# EAGLE design Bottom (EAGLE 9.2.2)
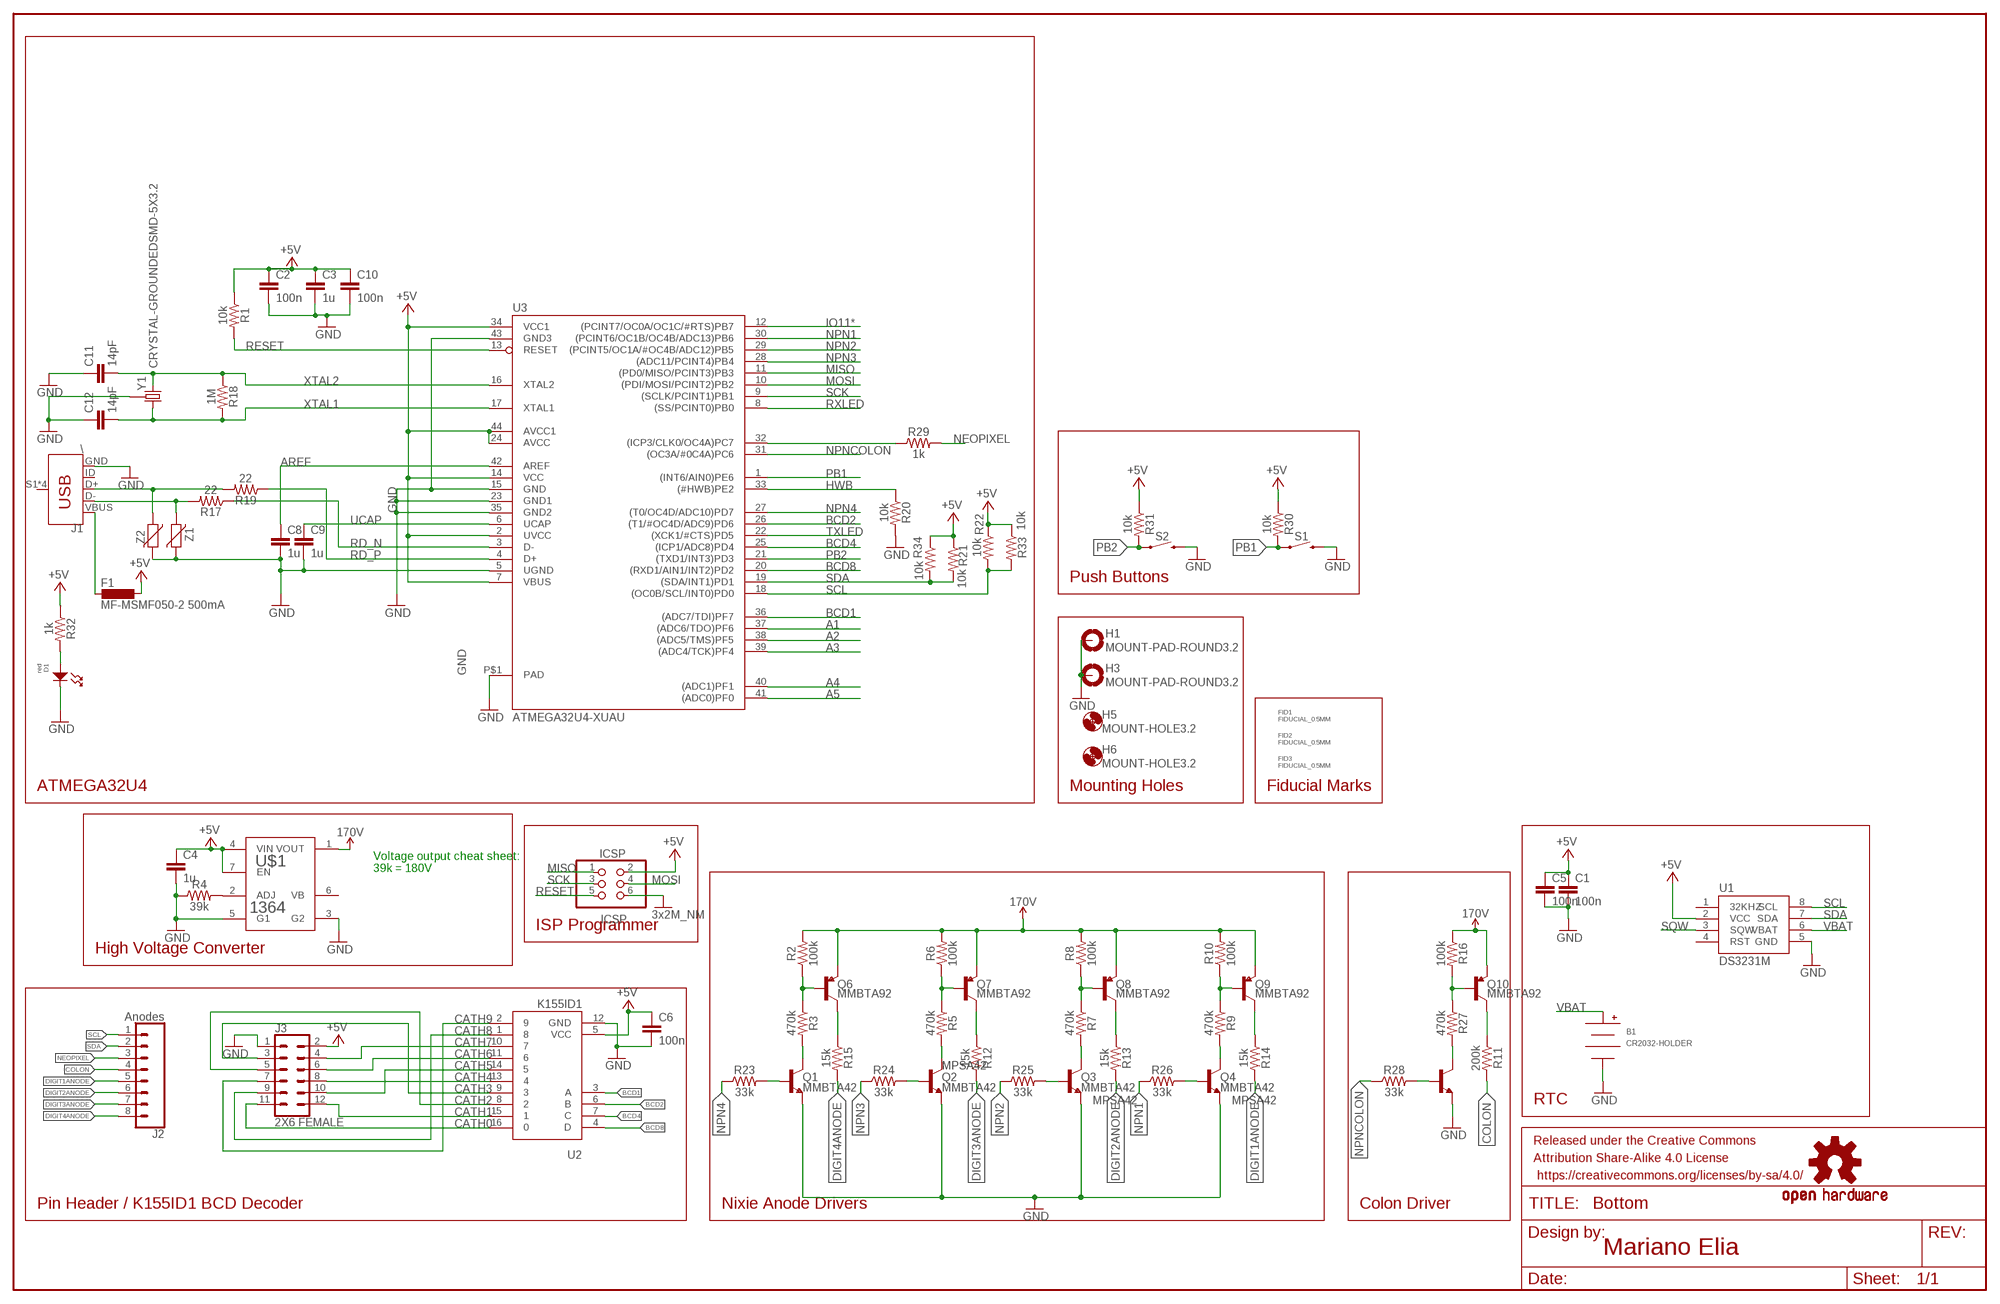
[diagram p0: schematic, sheet 1]

## Parts
B1  CR2032-HOLDER  [CH28-2032LF]
C1  100n  2.2UF-0805-25V-(+80/-20%)  [0805]
C2  100n  2.2UF-0805-25V-(+80/-20%)  [0805]
C3  1u  2.2UF-0805-25V-(+80/-20%)  [0805]
C4  1u  2.2UF-0805-25V-(+80/-20%)  [0805]
C5  100n  2.2UF-0805-25V-(+80/-20%)  [0805]
C6  100n  2.2UF-0805-25V-(+80/-20%)  [0805]
C8  1u  2.2UF-0805-25V-(+80/-20%)  [0805]
C9  1u  2.2UF-0805-25V-(+80/-20%)  [0805]
C10  100n  2.2UF-0805-25V-(+80/-20%)  [0805]
C11  14pF  2.2UF-0805-25V-(+80/-20%)  [0805]
C12  14pF  2.2UF-0805-25V-(+80/-20%)  [0805]
D1  red  LED_SINGLE-0805  [LED0805]
F1  MF-MSMF050-2 500mA  L-EUL1812  [L1812]
FID1  FIDUCIAL_0.5MM  [FIDUCIAL_0.5MM]
FID2  FIDUCIAL_0.5MM  [FIDUCIAL_0.5MM]
FID3  FIDUCIAL_0.5MM  [FIDUCIAL_0.5MM]
FRAME1  FRAME-LEDGER  [CREATIVE_COMMONS]
H1  MOUNT-PAD-ROUND3.2  [3,2-PAD]
H3  MOUNT-PAD-ROUND3.2  [3,2-PAD]
H5  MOUNT-HOLE3.2  [3,2]
H6  MOUNT-HOLE3.2  [3,2]
ICSP  ICSP  PINHD-2X3  [2X03]
J1  \  USB_MINI-B_SMT  [USB-MINIB]
J2  Anodes  CONN_08NO_SILK_FEMALE_PTH  [1X08_NO_SILK]
J3  2X6 FEMALE  CONN_06X2NO_SILK  [2X6_NOSILK]
LOGO1  OSHW-LOGOL  [OSHW-LOGO-L]
Q1  MMBTA42  TRANS_NPN-MMBTA42  [SOT23-3]
Q2  MMBTA42  TRANS_NPN-MMBTA42  [SOT23-3]
Q3  MMBTA42  TRANS_NPN-MMBTA42  [SOT23-3]
Q4  MMBTA42  TRANS_NPN-MMBTA42  [SOT23-3]
Q5  MMBTA42  TRANS_NPN-MMBTA42  [SOT23-3]
Q6  MMBTA92  TRANS_PNP-MMBT4403  [SOT23-3]
Q7  MMBTA92  TRANS_PNP-MMBT4403  [SOT23-3]
Q8  MMBTA92  TRANS_PNP-MMBT4403  [SOT23-3]
Q9  MMBTA92  TRANS_PNP-MMBT4403  [SOT23-3]
Q10  MMBTA92  TRANS_PNP-MMBT4403  [SOT23-3]
R1  10k  0.75OHM-0805-1/4W-1%  [0805]
R2  100k  0.75OHM-0805-1/4W-1%  [0805]
R3  470k  0.75OHM-0805-1/4W-1%  [0805]
R4  39k  0.3OHM-0805-1/8W-1%  [0805]
R5  470k  0.75OHM-0805-1/4W-1%  [0805]
R6  100k  0.75OHM-0805-1/4W-1%  [0805]
R7  470k  0.75OHM-0805-1/4W-1%  [0805]
R8  100k  0.75OHM-0805-1/4W-1%  [0805]
R9  470k  0.75OHM-0805-1/4W-1%  [0805]
R10  100k  0.75OHM-0805-1/4W-1%  [0805]
R11  200k  0.75OHM-0805-1/4W-1%  [0805]
R12  15k  0.75OHM-0805-1/4W-1%  [0805]
R13  15k  0.75OHM-0805-1/4W-1%  [0805]
R14  15k  0.75OHM-0805-1/4W-1%  [0805]
R15  15k  0.75OHM-0805-1/4W-1%  [0805]
R16  100k  0.75OHM-0805-1/4W-1%  [0805]
R17  22  0.75OHM-0805-1/4W-1%  [0805]
R18  1M  0.75OHM-0805-1/4W-1%  [0805]
R19  22  0.75OHM-0805-1/4W-1%  [0805]
R20  10k  0.75OHM-0805-1/4W-1%  [0805]
R21  10k  0.75OHM-0805-1/4W-1%  [0805]
R22  10k  0.75OHM-0805-1/4W-1%  [0805]
R23  33k  0.75OHM-0805-1/4W-1%  [0805]
R24  33k  0.75OHM-0805-1/4W-1%  [0805]
R25  33k  0.75OHM-0805-1/4W-1%  [0805]
R26  33k  0.75OHM-0805-1/4W-1%  [0805]
R27  470k  0.75OHM-0805-1/4W-1%  [0805]
R28  33k  0.75OHM-0805-1/4W-1%  [0805]
R29  1k  0.75OHM-0805-1/4W-1%  [0805]
R30  10k  0.75OHM-0805-1/4W-1%  [0805]
R31  10k  0.75OHM-0805-1/4W-1%  [0805]
R32  1k  0.75OHM-0805-1/4W-1%  [0805]
R33  10k  0.75OHM-0805-1/4W-1%  [0805]
R34  10k  0.75OHM-0805-1/4W-1%  [0805]
S1  MOMENTARY-SWITCH-SPST-PTH-RIGHT-ANGLE-KIT  [TACTILE_SWITCH_PTH_RIGHT_ANGLE_KIT]
S2  MOMENTARY-SWITCH-SPST-PTH-RIGHT-ANGLE-KIT  [TACTILE_SWITCH_PTH_RIGHT_ANGLE_KIT]
U1  DS3231M  [SO08]
U2  K155ID1  [DIL16-KIT]
U3  ATMEGA32U4-XUAU  [TQFP44-PAD]
U$1  1364  [1364]
Y1  CRYSTAL-GROUNDEDSMD-5X3.2  [CRYSTAL-SMD-5X3.2-4PAD]
Z1  VARISTORCN0603  [CT/CN0603]
Z2  VARISTORCN0603  [CT/CN0603]

## Nets
170V [170V]: Q6.2(E) Q7.2(E) Q8.2(E) Q9.2(E) Q10.2(E) R2.2 R6.2 R8.2 R10.2 R16.1 U$1.1(VOUT)
+5V [5V]: C1.1 C2.1 C3.1 C4.1 C5.1 C6.1 C10.1 F1.1 ICSP.2 J3.2 R1.1 R21.1 R22.1 R30.1 R31.1 R32.1 R33.1 R34.1 U1.2(VCC) U2.5(VCC) U3.2(UVCC) U3.7(VBUS) U3.14(VCC) U3.24(AVCC) U3.34(VCC1) U3.44(AVCC1) U$1.4(VIN) U$1.7(EN)
A1: U3.37((ADC6/TDO)PF6)
A2: U3.38((ADC5/TMS)PF5)
A3: U3.39((ADC4/TCK)PF4)
A4: U3.40((ADC1)PF1)
A5: U3.41((ADC0)PF0)
AREF [aref]: C8.1 U3.42(AREF)
BCD1: U2.3(A) U3.36((ADC7/TDI)PF7)
BCD2: U2.6(B) U3.26((T1/#OC4D/ADC9)PD6)
BCD4: U2.7(C) U3.25((ICP1/ADC8)PD4)
BCD8: U2.4(D) U3.20((RXD1/AIN1/INT2)PD2)
CATH0: J3.11 U2.16
CATH1: J3.12 U2.15
CATH2: J3.5 U2.8
CATH3: J3.3 U2.9
CATH4: J3.8 U2.13
CATH5: J3.10 U2.14
CATH6: J3.6 U2.11
CATH7: J3.4 U2.10
CATH8: J3.9 U2.1
CATH9: J3.7 U2.2
COLON: J2.4 R11.2
D_N [USBDiff]: J1.D- R17.2 Z1.1
D_P [USBDiff]: J1.D+ R19.2 Z2.1
DIGIT1ANODE: J2.5 R14.2
DIGIT2ANODE: J2.6 R13.2
DIGIT3ANODE: J2.7 R12.2
DIGIT4ANODE: J2.8 R15.2
GND: B1.NEG C1.2 C2.2 C3.2 C4.2 C5.2 C6.2 C8.2 C9.2 C10.2 C11.1 C12.1 D1.CATHODE H1.B3,2(MOUNT) H3.B3,2(MOUNT) ICSP.6 J1.GND J3.1 Q1.2(E) Q2.2(E) Q3.2(E) Q4.2(E) Q5.2(E) R4.1 R20.2 S1.2 S2.2 U1.5(GND) U2.12(GND) U3.5(UGND) U3.15(GND) U3.23(GND1) U3.35(GND2) U3.43(GND3) U3.P$1(PAD) U$1.3(G2) U$1.5(G1) Y1.2 Y1.4 Z1.2 Z2.2 ; supply symbol labelled 3x2M_NM
HWB: R20.1 U3.33((#HWB)PE2)
IO11*: U3.12((PCINT7/OC0A/OC1C/#RTS)PB7)
MISO: ICSP.1 U3.11((PD0/MISO/PCINT3)PB3)
MOSI: ICSP.4 U3.10((PDI/MOSI/PCINT2)PB2)
N$1: Q1.1(B) R23.2
N$2: Q2.1(B) R24.2
N$3: R4.2 U$1.2(ADJ)
N$4: Q3.1(B) R25.2
N$5: Q4.1(B) R26.2
N$6: Q6.1(B) R2.1 R3.1
N$7: Q1.3(C) R3.2
N$8: Q7.1(B) R5.1 R6.1
N$9: Q8.1(B) R7.1 R8.1
N$10: Q9.1(B) R9.1 R10.1
N$11: Q4.3(C) R9.2
N$12: Q2.3(C) R5.2
N$14: Q3.3(C) R7.2
N$15: Q5.1(B) R28.2
N$16: Q10.1(B) R16.2 R27.1
N$17: R29.1 U3.32((ICP3/CLK0/OC4A)PC7)
N$18: Q5.3(C) R27.2
N$19: D1.ANODE R32.2
N$20: Q10.3(C) R11.1
N$23: Q7.3(C) R12.1
N$24: Q6.3(C) R15.1
N$25: Q8.3(C) R13.1
N$27: Q9.3(C) R14.1
NEOPIXEL: J2.3 R29.2
NPN1: R26.1 U3.30((PCINT6/OC1B/OC4B/ADC13)PB6)
NPN2: R25.1 U3.29((PCINT5/OC1A/#OC4B/ADC12)PB5)
NPN3: R24.1 U3.28((ADC11/PCINT4)PB4)
NPN4: R23.1 U3.27((T0/OC4D/ADC10)PD7)
NPNCOLON: R28.1 U3.31((OC3A/#0C4A)PC6)
PB1: R30.2 S1.1 U3.1((INT6/AIN0)PE6)
PB2: R31.2 S2.1 U3.21((TXD1/INT3)PD3)
RD_N [USBDiff]: R17.1 U3.3(D-)
RD_P [USBDiff]: R19.1 U3.4(D+)
RESET: ICSP.5 R1.2 U3.13(RESET)
RXLED: U3.8((SS/PCINT0)PB0)
SCK: ICSP.3 U3.9((SCLK/PCINT1)PB1)
SCL: J2.1 R22.2 R33.2 U1.8(SCL) U3.18((OC0B/SCL/INT0)PD0)
SDA: J2.2 R21.2 R34.2 U1.7(SDA) U3.19((SDA/INT1)PD1)
SQW: U1.3(SQW)
TXLED: U3.22((XCK1/#CTS)PD5)
UCAP: C9.1 U3.6(UCAP)
VBAT: B1.POS U1.6(VBAT)
VBUS: F1.2 J1.VBUS
XTAL1: C12.2 R18.2 U3.17(XTAL1) Y1.1
XTAL2: C11.2 R18.1 U3.16(XTAL2) Y1.3
Unconnected: J1.ID J1.S1(SHIELD) J1.S2(SHIELD) J1.S3(SHIELD) J1.S4(SHIELD) U1.1(32KHZ) U1.4(RST) U$1.6(VB)

## Notes on the sheet
- Push Buttons
- ATMEGA32U4 | Mounting Holes | Fiducial Marks
- Voltage output cheat sheet:
  39k = 180V
- ISP Programmer
- High Voltage Converter
- RTC
- Pin Header / K155ID1 BCD Decoder | Nixie Anode Drivers | Colon Driver
- Mariano Elia

## Library data of the parts
B1 = battery-holder:CR2032-HOLDER
C1-C6 C8-C12 = SparkFun-Capacitors:2.2UF: 2.2µF ceramic capacitors A capacitor is a passive two-terminal electrical component used to store electrical energy temporarily in an electric field.; PROD_ID: CAP-11624; VALUE: 2.2uF
D1 = MF_LEDs:LED_SINGLE: Library: MF_LEDs Description: Device for Single LED Packages. Manufacture part number (MFG#) can be added via Attributes.; HOUSEPART: NO; POPULATE: 1
F1 = rcl:L-EU: INDUCTOR, European symbol; SPICEPREFIX: L
FID1-FID3 = MF_Aesthetics:FIDUCIAL: Library: MF_Aesthetics Description: Fiducial marking for PCB alignment inside PNP and other machines.; HOUSEPART: NO; POPULATE: 0
FRAME1 = SparkFun-Aesthetics:FRAME-LEDGER: Schematic Frame - Ledger Standard 11x14 US Ledger frame
H1 H3 = holes:MOUNT-PAD-ROUND: MOUNTING PAD, round
H5 H6 = holes:MOUNT-HOLE: MOUNTING HOLE with drill center marker
ICSP = SmartPrj:PINHD-2X3: PIN HEADER
J1 = SparkFun-Connectors:USB_MINI-B: USB type Mini-B Connector Breaks out 5th pin, and includes shield pins if needed. SparkFun Products: SparkFun FTDI Basic Breakout <https://www.sparkfun.com/products/9716> SparkFun XBee Explorer USB <https://www.sparkfun.com/products/11812> SparkFun Redboard <https://www.sparkfun.com/products/12757>; PROD_ID: CONN-08193; SF_ID: PRT-00587
J2 = SparkFun-Connectors:CONN_08: Multi connection point. Often used as Generic Header-pin footprint for 0.1 inch spaced/style header connections On any of the 0.1 inch spaced packages, you can populate with these: Break Away Headers - Straight <https://www.sparkfun.com/products/116> (PRT-00116) Break Away Male Headers - Right Angle <https://www.sparkfun.com/products/553> (PRT-00553) Female Headers <https://www.sparkfun.com/products/115> (PRT-00115) Break Away Headers - Machine Pin <https://www.sparkfun.com/products/117> (PRT-00117) Break Away Female Headers - Swiss Machine Pin <https://www.sparkfun.com/products/743> (PRT-00743) Arduino Stackable Header - 8 Pin <https://www.sparkfun.com/products/9279> (PRT-09279) For SCREWTERMINALS and SPRING TERMINALS visit here: Screw Terimnals on SparkFun.com <https://www.sparkfun.com/search/results?term=Screw+Terminals> (5mm/3.5mm/2.54mm spacing) This device is also useful as a general connection point to wire up your design to another part of your project. Our various solder wires solder well into these plated through hole pads. Hook-Up Wire - Assortment (Stranded, 22 AWG) <https://www.sparkfun.com/products/11375> (PRT-11375) Hook-Up Wire - Assortment (Solid Core, 22 AWG) <https://www.sparkfun.com/products/11367> (PRT-11367) View the entire wire category on our website here <https://www.sparkfun.com/categories/141> Special notes: Molex polarized connector foot print use with SKU : PRT-08231 with associated crimp pins and housings. 1MM SMD Version SKU: PRT-10208 NOTES ON THE VARIANTS LOCK and LOCK_LONGPADS... This footprint was designed to help hold the alignment of a through-hole component (i.e. 6-pin header) while soldering it into place. You may notice that each hole has been shifted either up or down by 0.005 of an inch from it's more standard position (which is a perfectly straight line). This slight alteration caused the pins (the squares in the middle) to touch the edges of the holes. Because they are alternating, it causes a "brace" to hold the component in place. 0.005 has proven to be the perfect amount of "off-center" position when using our standard breakaway headers. Although looks a little odd when you look at the bare footprint, once you have a header in there, the alteration is very hard to notice. Also,if you push a header all the way into place, it is covered up entirely on the bottom side.; PROD_ID: CONN-08438
J3 = SparkFun-Connectors:CONN_06X2: Multi connection point. Often used as Generic Header-pin footprint for 0.1 inch spaced/style header connections On any of the 0.1 inch spaced packages, you can populate with these: Break Away Headers - Straight <https://www.sparkfun.com/products/116> (PRT-00116) Break Away Male Headers - Right Angle <https://www.sparkfun.com/products/553> (PRT-00553) Female Headers <https://www.sparkfun.com/products/115> (PRT-00115) Break Away Headers - Machine Pin <https://www.sparkfun.com/products/117> (PRT-00117) Break Away Female Headers - Swiss Machine Pin <https://www.sparkfun.com/products/743> (PRT-00743)
LOGO1 = SparkFun-Aesthetics:OSHW-LOGO: Open-Source Hardware (OSHW) Logo This logo indicates the piece of hardware it is found on incorporates a OSHW license and/or adheres to the definition of open source hardware found here: http://freedomdefined.org/OSHW
Q1-Q5 = SparkFun-DiscreteSemi:TRANS_NPN: NPN transistor Current controlled devices typically used to amplify current or used as a switch. BC547 - COM-08928 <http://www.sparkfun.com/products/8928> (TO-92 45V 100mA) (1.Collector 2.Base 3.Emitter) 2N3904 - COM-00521 <http://www.sparkfun.com/products/521> (TO-92 40V 200mA) (1.Emitter 2.Base 3.Collector) P2N2222A - COM-12852 <http://www.sparkfun.com/products/12852> (TO-92 40V 600mA) (1.Collector 2.Base 3.Emitter); PROD_ID: TRANS-09116; VALUE: 500mA/300V
Q6-Q10 = SparkFun-DiscreteSemi:TRANS_PNP: PNP transistor Current controlled devices typically used to amplify current or used as a switch. SparkFun Products: SparkFun Serial Enabled 16x2 LCD - Red on Black <https://www.sparkfun.com/products/9068> SparkFun Logomatic <https://www.sparkfun.com/products/12772>; PROD_ID: TRANS-09245; VALUE: 600mA/40V
R1-R3 R5-R34 = SparkFun-Resistors:0.75OHM: 0.75Ω resistor A resistor is a passive two-terminal electrical component that implements electrical resistance as a circuit element. Resistors act to reduce current flow, and, at the same time, act to lower voltage levels within circuits. - Wikipedia; PROD_ID: RES-08474; VALUE: 0.75
R4 = SparkFun-Resistors:0.3OHM: 0.3Ω resistor A resistor is a passive two-terminal electrical component that implements electrical resistance as a circuit element. Resistors act to reduce current flow, and, at the same time, act to lower voltage levels within circuits. - Wikipedia; PROD_ID: RES-11622; VALUE: 0.3
S1 S2 = SparkFun-Switches:MOMENTARY-SWITCH-SPST: Momentary Switch (Pushbutton) - SPST Normally-open (NO) SPST momentary switches (buttons, pushbuttons). Variants PTH-12MM - 12mm square, through-hole Momentary Pushbutton Switch - 12mm Square <https://www.sparkfun.com/products/9190> (COM-09190) PTH-6.0MM, PTH-6.0MM-KIT - 6.0mm square, through-hole Mini Pushbutton Switch <https://www.sparkfun.com/products/97> (COM-00097) KIT package intended for soldering kit's - only one side of pads' copper is exposed. PTH-RIGHT-ANGLE-KIT - Right-angle, through-hole Right Angle Tactile Button <https://www.sparkfun.com/products/10791> - Used on SparkFun BigTime Watch Kit <https://www.sparkfun.com/products/11734> SMD-12MM - 12mm square, surface-mount Tactile Button - SMD (12mm) <https://www.sparkfun.com/products/12993> (COM-12993) Used on SparkFun PicoBoard <https://www.sparkfun.com/products/11888> SMD-4.5MM - 4.5mm Square Trackball Switch Used on SparkFun Blackberry Trackballer Breakout <https://www.sparkfun.com/products/13169> SMD-4.6MMX2.8MM - 4.60mm x 2.80mm, surface mount Used on SparkFun SAMD21 Mini Breakout <https://www.sparkfun.com/products/13664> SMD-5.2MM, SMD-5.2-REDUNDANT - 5.2mm square, surface-mount Mini Pushbutton Switch - SMD <https://www.sparkfun.com/products/8720> (COM-08720) Used on Arduino Pro Mini <https://www.sparkfun.com/products/11114> REDUNDANT package connects both switch circuits together SMD-6.0X3.5MM - 6.0 x 3.5mm, surface mount Momentary Reset Switch SMD <https://www.sparkfun.com/products/8229> (COM-08229) SMD-6.2MM-TALL - 6.2mm square, surface mount Tactile Button - SMD (6mm) <https://www.sparkfun.com/products/12992> Used on SparkFun Digital Sandbox <https://www.sparkfun.com/products/12651> SMD-RIGHT-ANGLE - Right-angle, surface mount Used on SparkFun Block for Intel® Edison - Arduino <https://www.sparkfun.com/products/13036>; PROD_ID: CONN-10672; SF_SKU: COM-10791
U1 = SparkFun-Clocks:DS3231M: DS3231M Real Time Clock Accuracy +/-5ppm. Battery Backup. 2.3V to 5.5V. Datasheet <https://cdn.sparkfun.com/datasheets/Dev/Beagle/DS3231M.pdf> SparkFun Products CryptoCape <https://www.sparkfun.com/products/12773> (DEV-12773) SparkFun CryptoShield <https://www.sparkfun.com/products/13183> (DEV-13183); PROD_ID: IC-11985
U2 = Nixie:K155ID1
U3 = SmartPrj:ATMEGA32U4-XU
U$1 = TES:1364: TES1364 HVPS Horizontal module
Y1 = SparkFun-Clocks:CRYSTAL-GROUNDED: Crystals w/ Ground Pin (Generic) These are passive quartz crystals, which can be used as a clock source for a microcontroller. Crystal's are usually two-terminal devices. A third terminal may be optionally connected to ground, as recommended by the manufaturer.
Z1 Z2 = varistor:VARISTOR: VARISTOR

## Net classes
1 5V: width 0.3 mm, drill 0.4 mm, clearance 0.3 mm
2 GND: width 0.3 mm, drill 0.4 mm, clearance 0.254 mm
3 170V: width 0.254 mm, drill 0.4 mm, clearance 0.4 mm
4 aref: width 0.254 mm, drill 0.61 mm, clearance 0.254 mm
5 USBDiff: width 0.3 mm, drill 0.4 mm, clearance 0.1 mm

## Board
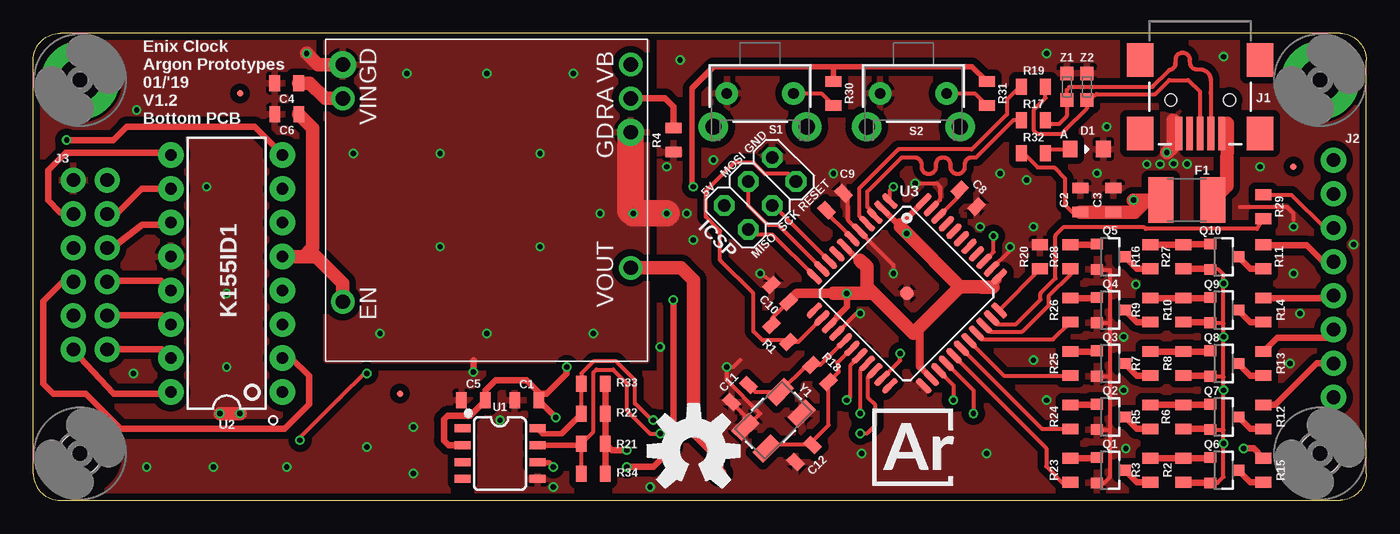
[diagram p1: board, top side]
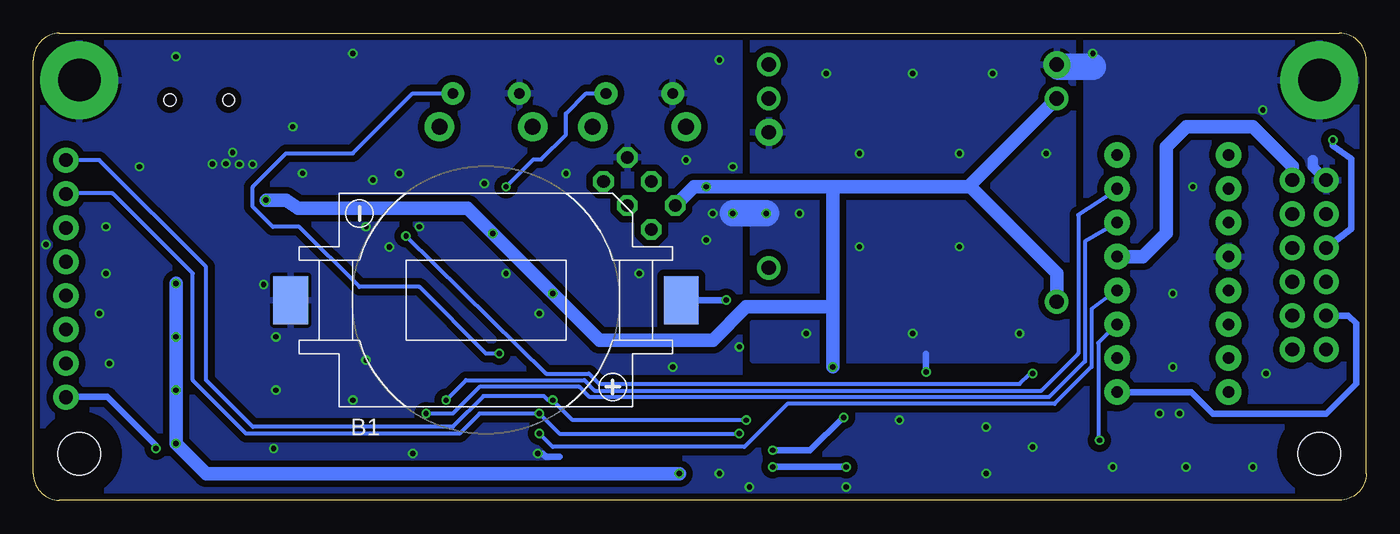
[diagram p2: board, bottom side, seen from below]

Size 99.95 x 35 mm. Coordinates in mm from the lower left corner, seen from the top.
Outline: 99.95,2 99.95,33 arc90 98,35 2,35 arc90 0,33 0,2 arc90 2,0 98,0 arc90 99.95,2
Copper layers (1*16): Top 0.035mm / dielectric 1.5mm / Bottom 0.035mm
Design rules "MF_4_mil_drill_2_Layer": minimum track width 5mil, minimum drill 4mil, track to track 5mil, track to pad 5mil, pad to pad 5mil, via to via 5mil, smd to smd 0mil, copper to edge 10mil, drill to drill 10mil, minimum pad ring 6mil, minimum via ring 6mil, stop-mask expansion 2mil, vias tented up to drill 25mil, thermal gap 10mil

### Footprints (pad centres in the part's own frame; a part is rotated, then mirrored left to right if it is on the bottom)
CH28-2032LF = smd 3.6 x 2.6: NEG 0,-14.65; POS 0,14.65
0805 = smd 0.8 x 1.2: 1 -0.9,0; 2 0.9,0
LED0805 = smd 1.1 x 1.25: ANODE 1.25,0; CATHODE -1.25,0
L1812 = smd 1.9 x 3.4: 1 -1.95,0; 2 1.95,0
FIDUCIAL_0.5MM = smd 0.5 x 0.5: FID 0,0
3,2-PAD = drill 3.2 pad 5.842: B3,2 0,0
3,2 = hole 3.2: 0,0
2X03 = drill 0.95 pad 1.55 octagon: 1 -2.54,-1.27; 2 -2.54,1.27; 3 0,-1.27; 4 0,1.27; 5 2.54,-1.27; 6 2.54,1.27
USB-MINIB = smd 2.5 x 0.5: D+ 2.5,0; D- 2.5,0.8; GND 2.5,-1.6; ID 2.5,-0.8; VBUS 2.5,1.6 | smd 2.5 x 2: S1 -3,4.5; S2 2.5,4.5; S3 -3,-4.5; S4 2.5,-4.5 | hole 0.9: 0,2.2; 0,-2.2
1X08_NO_SILK = drill 1.016 pad 1.88: 1 0,0; 2 2.54,0; 3 5.08,0; 4 7.62,0; 5 10.16,0; 6 12.7,0; 7 15.24,0; 8 17.78,0
2X6_NOSILK = drill 1.016 pad 1.88: 1 0,0; 2 0,2.54; 3 2.54,0; 4 2.54,2.54; 5 5.08,0; 6 5.08,2.54; 7 7.62,0; 8 7.62,2.54; 9 10.16,0; 10 10.16,2.54; 11 12.7,0; 12 12.7,2.54
SOT23-3 = smd 0.8 x 0.9: 1 -0.95,-1; 2 0.95,-1; 3 0,1.1
TACTILE_SWITCH_PTH_RIGHT_ANGLE_KIT = drill 0.8 pad 1.7: 1 -2.5,0; 2 2.5,0 | drill 1.2 pad 2.2: ANCHOR1 -3.5,2.5; ANCHOR2 3.5,2.5
SO08 = smd 0.6 x 1.2: 1 -1.905,-2.8; 2 -0.635,-2.8; 3 0.635,-2.8; 4 1.905,-2.8; 5 1.905,2.8; 6 0.635,2.8; 7 -0.635,2.8; 8 -1.905,2.8
DIL16-KIT = drill 0.864 pad 1.905: 1 -8.89,-4.191; 2 -6.35,-4.191; 3 -3.81,-4.191; 4 -1.27,-4.191; 5 1.27,-4.191; 6 3.81,-4.191; 7 6.35,-4.191; 8 8.89,-4.191; 9 8.89,4.191; 10 6.35,4.191; 11 3.81,4.191; 12 1.27,4.191; 13 -1.27,4.191; 14 -3.81,4.191; 15 -6.35,4.191; 16 -8.89,4.191
TQFP44-PAD = smd 1.4 x 0.45: 1 -5.8,4; 2 -5.8,3.2; 3 -5.8,2.4; 4 -5.8,1.6; 5 -5.8,0.8; 6 -5.8,0; 7 -5.8,-0.8; 8 -5.8,-1.6; 9 -5.8,-2.4; 10 -5.8,-3.2; 11 -5.8,-4; 23 5.8,-4; 24 5.8,-3.2; 25 5.8,-2.4; 26 5.8,-1.6; 27 5.8,-0.8; 28 5.8,0; 29 5.8,0.8; 30 5.8,1.6; 31 5.8,2.4; 32 5.8,3.2; 33 5.8,4 | smd 0.45 x 1.4: 12 -4,-5.8; 13 -3.2,-5.8; 14 -2.4,-5.8; 15 -1.6,-5.8; 16 -0.8,-5.8; 17 0,-5.8; 18 0.8,-5.8; 19 1.6,-5.8; 20 2.4,-5.8; 21 3.2,-5.8; 22 4,-5.8; 34 4,5.8; 35 3.2,5.8; 36 2.4,5.8; 37 1.6,5.8; 38 0.8,5.8; 39 0,5.8; 40 -0.8,5.8; 41 -1.6,5.8; 42 -2.4,5.8; 43 -3.2,5.8; 44 -4,5.8 | smd 1 x 1: P$1 0,0
1364 = drill 1.067 pad 1.778: 1 5.08,10.795; 2 -7.62,10.795; 4 -7.62,-10.795; 6 -10.16,10.795; 7 7.62,-10.795 | drill 1.067 pad 2.032: 3 -5.08,10.795; 5 -10.16,-10.795
CRYSTAL-SMD-5X3.2-4PAD = smd 1.9 x 1.1: 1 -1.85,-1.15; 2 1.85,-1.15; 3 1.85,1.15; 4 -1.85,1.15
CT/CN0603 = smd 1 x 1: 1 -1,0; 2 1,0

### Placement (x,y rotation side)
B1  66,15 270 bottom
C1  37,7.5 180 top
C2  78.5,22.5 90 top
C3  81,22.5 90 top
C4  19,31.27 180 top
C5  33,7.5 180 top
C6  19.01,28.92 180 top
C8  70.1,22.65 315 top
C9  60.12,22.38 45 top
C10  56,15.5 135 top
C11  53,8 45 top
C12  57.8,3.5 45 top
D1  78.99,26.32 180 top
F1  86.5,22.5 0 top
FID1  27.5,8 0 top
FID2  94.5,25 0 top
FID3  15.5,30.5 0 top
FRAME1  15,-12.25 0 top  (outside the outline)
H1  3.5,31.5 0 top
H3  96.5,31.5 0 top
H5  96.5,3.5 0 top
H6  3.5,3.5 0 top
ICSP  54.5,23 45 top
J1  87.5,30 270 top
J2  97.5,25.5 270 top
J3  3,24 270 top
LOGO1  49.52,3.71 0 top
Q1  80.75,2.25 270 top
Q2  80.75,6.25 270 top
Q3  80.75,10.25 270 top
Q4  80.75,14.25 270 top
Q5  80.75,18.25 270 top
Q6  89.25,2.25 270 top
Q7  89.25,6.25 270 top
Q8  89.25,10.25 270 top
Q9  89.25,14.25 270 top
Q10  89.25,18.25 270 top
R1  56,12.5 315 top
R2  86.25,2.25 270 top
R3  83.75,2.25 270 top
R4  48,27 90 top
R5  83.75,6.25 270 top
R6  86.25,6.25 270 top
R7  83.75,10.25 270 top
R8  86.25,10.25 270 top
R9  83.75,14.25 270 top
R10  86.25,14.25 270 top
R11  92.25,18.25 90 top
R12  92.25,6.25 90 top
R13  92.25,10.25 90 top
R14  92.25,14.25 90 top
R15  92.25,2.25 90 top
R16  86.25,18.25 90 top
R17  75,28.5 0 top
R18  59,9.5 315 top
R19  75,31 0 top
R20  75.5,18.25 90 top
R21  42,4.25 180 top
R22  42,6.5 180 top
R23  77.75,2.25 90 top
R24  77.75,6.25 90 top
R25  77.75,10.25 90 top
R26  77.75,14.25 90 top
R27  83.75,18.25 270 top
R28  77.75,18.25 90 top
R29  92.25,22 90 top
R30  60,30.5 270 top
R31  71.5,30.5 270 top
R32  75,26 0 top
R33  42,8.75 180 top
R34  42,2 180 top
S1  54.5,30.5 180 top
S2  66,30.5 180 top
U1  35,3.5 270 top
U2  14.5,17 90 top
U3  65.5,15.5 315 top
U$1  34,22.5 270 top
Y1  55.5,6 45 top
Z1  77.5,31 90 top
Z2  79,31 90 top

### Tracks (layer width: path | path; a pad name or v marks a point on that pad's centre or on a via)
170V  (via drill 0.4)
  Top 0.3: 86.3,1.3 R2.2 | Q6.2 88.81,1.3 89.25,1.75 v89.25,4.25 89.25,5.25 | 89.25,5.25 v89.25,8.25 89.25,9.25 | 89.25,9.25 v89.25,12.25 89.25,13.25 | 89.25,5.25 89.2,5.3 Q7.2 88.2,5.35 | Q8.2 89.2,9.3 89.25,9.25 | Q9.2 89.2,13.3 89.25,13.25 | Q10.2 88.88,17.3 89.25,16.93 v89.25,16.25 89.25,13.25
  Top 0.5: Q6.2 86.3,1.3 | R6.2 88.2,5.35 | R8.2 88.2,9.35 Q8.2 | R10.2 88.2,13.35 Q9.2 | R16.1 88.2,17.35 Q10.2
  Top 1: v51.5,2 51.25,2.25 51.25,3.52 49.5,5.27 49.5,16.5 48.58,17.42 U$1.1
  Bottom 1: v89.25,16.25 v89.25,4.25 87,2 v51.5,2
+5V  (via drill 0.4)
  Top 0.3: R1.1 55.36,13.59 C10.1 56.89,15.11 | C1.1 38,8 | R32.1 74.26,26 75.31,24.95 76.55,24.95 77.36,24.14 77.36,22.14 77.9,21.6 C2.1 | U3.34 72.43,16.43 71.96,15.96
  Top 0.4: R31.1 70.4,32.5 60,32.5 | 60,32.5 R30.1 | 60,32.5 51,32.5 49.4,30.9 49.4,23.6 v49.5,23.5
  Top 0.5: U3.7 61.87,18 62,18 | U3.24 67.34,9.16 66.5,10 | 38,8 38.5,8 40,9.5 v40,10 | R33.1 R22.1 R21.1 | R21.1 R34.1 | R21.1 43.4,3.75 v44.5,3.75 | U3.14 59.7,13.13 60.27,13.7 60.27,13.77 61,14.5 v61,15.5 | U3.2 65.01,20.51 65.01,20.67 U3.44 | v39.17,6.2 39.17,6.22 C1.1 37.9,8.1 37,9 34.65,9 33.9,8.25 C5.1 32.74,6.34 31.08,6.34 30.8,6.06 30.8,4.47 31.14,4.13 U1.2
  Top 0.6: 66.5,10 66.5,13
  Top 0.7: 60,15.5 57.27,15.5 56.89,15.11
  Top 1: U$1.7 23.2,16.27 21.21,18.27 U2.5 20.27,18.27 20.96,18.96 20.96,27.87 C6.1 | 69.5,16 71.08,16 71.12,15.96 71.96,15.96 | 69.5,16 66.5,13 66,12.5 63,15.5 | 69.5,16 v65.5,20 65.01,20.49 65.01,20.67 | 63,15.5 62.5,16 62.5,17.5 62,18 | 63,15.5 v61,15.5 60,15.5 | F1.1 83.5,22.5 | 83.5,22.5 v82.5,22.5 | 83.5,22.5 82.6,21.6 C3.1 C2.1 | C4.1 20.73,31.27 21.88,30.12 U$1.4
  Bottom 0.5: v44.5,3.75 41.7,3.75 39.25,6.2 v39.17,6.2
  Bottom 1: U2.5 16.73,18.27 15,20 15,26.5 13.5,28 8.5,28 5.54,25.04 J3.2 | 29.82,23.5 U$1.4 | U$1.7 23.2,17.02 29.68,23.5 29.82,23.5 | 29.82,23.5 40,23.5 | v40,10 40,14.5 | 40,14.5 40,23.5 | 40,23.5 v49.5,23.5 50.41,23.5 ICSP.2 | 40,14.5 46.5,14.5 49,12 57.5,12 v61,15.5 67.39,21.89 80.08,21.89 81,22.5 v82.5,22.5
AREF
  Top 0.3: U3.42 69.37,22.76 69.46,22.89 C8.1
BCD1  (via drill 0.4)
  Top 0.3: U3.36 72,18.61 v72,19.8 | v20,4.5 20,4.71 22.9,7.6 23.05,7.75 24.8,9.5 v25,9.5
  Bottom 0.3: U2.3 20.09,11.79 20.09,4.59 v20,4.5 | v72,19.8 61.5,9.5 58.29,9.5 57.52,8.72 26,8.72 25.22,9.5 v25,9.5
BCD2  (via drill 0.4)
  Top 0.3: U3.26 70.5,8.24 v70.5,6.5
  Bottom 0.3: U2.6 21.09,19.41 21.09,10.41 23.78,7.72 58.22,7.72 59,8.5 66.5,8.5 68.5,6.5 v70.5,6.5
BCD4  (via drill 0.4)
  Top 0.3: U3.25 69,8.61 v69,7.5
  Bottom 0.3: U2.7 18.69,23.29 21.59,21.39 21.59,11 24.37,8.22 57.85,8.22 58.62,9 67.5,9 v69,7.5
BCD8  (via drill 0.4)
  Top 0.3: v62,5 62.5,5 63.1,5.6 63.1,7.2 62.56,7.73 62.56,9.2 63.06,9.7 U3.20
  Bottom 0.3: U2.4 20.59,14.33 20.59,10 23.37,7.22 43.4,7.22 46.62,4 61,4 v62,5
CATH0
  Top 0.5: U2.16 10.19,8 6.02,8 3,11.26 J3.11
CATH1
  Top 0.5: U2.15 9.64,11.32 5.77,11.32 J3.12
CATH2  (via drill 0.4)
  Top 0.5: U2.8 16.58,28 7,28 6,27 v2.5,27
  Bottom 0.5: v2.5,27 2.5,26.57 1.1,25.61 1.1,20.36 J3.5
CATH3
  Top 0.5: U2.9 10.16,26.04 2.42,26.04 1.1,24.72 1.1,22.48 1.99,21.59 2.31,21.46 J3.3
CATH4
  Top 0.5: U2.13 9.57,16.46 5.68,16.46 5.62,16.55 J3.8
CATH5
  Top 0.5: U2.14 9.63,13.87 5.76,13.87 J3.10
CATH6
  Top 0.5: U2.11 10.14,20.64 8.16,20.64 5.93,18.92 J3.6
CATH7
  Top 0.5: J3.4 6.27,21.46 6.29,21.51 8.12,23.35 U2.10
CATH8
  Bottom 0.5: J3.9 1.34,13.84 0.76,13.26 0.76,8.74 3,6.5 11.5,6.5 13.11,8.11 U2.1
CATH9
  Top 0.5: J3.7 2.21,16.38 0.76,14.94 0.76,8.74 1.5,8 3.94,8 6.57,5.37 18.84,5.37 20.66,7.2 20.66,9.34 19.35,10.65 U2.2
COLON
  Top 0.5: R11.2 92.29,19.11 95.48,19.11 96.74,17.88 J2.4
D_N
  Top 0.3: R17.2 76.21,28.19 76.9,28.19 77.5,28.79 Z1.1 77.5,30.75 77.67,30.99 83.93,30.99 85.19,32.25 85.23,32.27 arc90 85.65,32.83 85.65,33.02 arc-90 86.17,33.54 86.2,33.54 arc-90 86.73,33.02 86.73,32.83 arc90 87.25,32.3 87.45,32.3 arc-90 88.3,31.51 88.3,30.59 | 88.3,30.59 88.3,30.5 | 88.3,30.5 J1.D- | 88.3,30.59 arc90 88.3,30.5
D_P
  Top 0.3: J1.D+ 87.5,30.61 86.61,31.5 85.17,31.5 84.12,30.45 79.75,30.45 Z2.1 79,29.36 77.44,27.81 | 77.44,27.81 | R19.2 75.9,30.14 75.05,29.29 75.05,27.71 75.31,27.45 77.09,27.45 77.44,27.81
DIGIT1ANODE
  Top 0.5: R14.2 97.31,15.15 J2.5
DIGIT2ANODE
  Top 0.5: R13.2 93.28,12.18 97.02,12.18 J2.6
DIGIT3ANODE
  Top 0.5: R12.2 93.15,7.15 96.26,10.26 J2.7
DIGIT4ANODE  (via drill 0.4)
  Top 0.5: R15.2 91.51,3.89 v90.76,3.89
  Bottom 0.5: v90.76,3.89 90.76,4.12 94.4,7.75 97.28,7.75 J2.8
GND  (via drill 0.4)
  Top 0.3: C9.2 61.1,22.67 61.1,21 61.93,20.17 U3.5 64.5,17.63 v64.5,17 | J1.GND 85.5,27.5 | U3.35 73.26,18.74 v73.25,18.98 | U3.15 61.74,14 v62,14 | 80.3,5.3 Q2.2 80.7,5.3 80.75,5.25 | 80.75,9.25 80.75,13.25 | 80.75,13.25 80.75,17.25 79.8,17.25 Q5.2 | Q4.2 80.7,13.3 80.75,13.25 | Q3.2 80.7,9.3 80.75,9.25 | Q1.2 80.3,1.3 80.75,1.75 80.75,5.25 | 80.75,5.25 80.75,9.25 | C10.2 55.64,16.14 v54.5,17 | C11.1 53.38,6.35 Y1.4 53.51,5.5 54.5,6.5 52,9 v52,10 52.5,10 53,10.5 | U3.43 68,22.52 68,23.5 67.75,23.75 v66.12,23.75 | 90.5,22 94,22 94.5,21.5 94.5,21
  Top 0.5: v33,9.62 33,10.5
  Top 1: v14,6.5 v15.5,6.5 | 85.5,28.5 85.5,27.5 85.5,26.5 v85,26.07 | U$1.5 21.34,32.66 v20.5,33.5
  Top 2: U$1.3 44.8,21.7 v45,21.5 v47.5,21.5
  Bottom 0.5: 60.5,3.25 61.5,3.25 61.75,3.5 v62.12,3.5 | 33,11 33,9.5
  Bottom 0.8: J3.1 4,25 4,25.5
  Bottom 1: U$1.5 23.05,32.5
  Bottom 2: 23.05,32.5 20.5,32.5 | v47.5,21.5 v45,21.5
  other vias: 14.5,10 13,23.5 14.5,15.5 30.5,19 38,19 38,26 30.5,26 13.5,2.5 19,2.5 25,4 48.5,2 28,32 40.5,32 42,12.5 34,32 34,12.5 26,12.5 7.75,29.25 42.5,21.5 75,20.5 82.68,16.16 81.75,12.25 81.92,3.87 81.75,8.25 47,11.5 76,7.5 99,19.18 80.5,28 76,33.5 51,25.5 49.5,19.5 83.5,25.18 71.5,3.5 75,10.5 89.25,33.25 72.5,24.5 46.25,1 7.5,9.5 60,24.5 94.5,20.5 24,26 94.5,17 94.25,10.25 48.5,33 8.5,2.5 49,21.5 74.5,24 92,25 86.51,25.21 79.76,24.52 84.48,25.19 85.52,25.23 95,14 47.5,25 71,20.5 39,1 35,6 28.5,5.5 28.5,2
  pour Top (isolate 0.5): 22,35 46,35 46,10.5 22,10.5
  pour Bottom (isolate 0.5): 100,35 100,0 0,0 0,35 21,35 21,9.5 47,9.5 47,35
  pour Bottom (isolate 0.5): 22,35 22,10.5 46,10.5 46,35
  pour Top (isolate 0.5): 100,35 47,35 47,9.5 21,9.5 21,35 0,35 0,0 100,0
HWB
  Top 0.3: U3.33 75.5,17.3 R20.1
MISO
  Top 0.3: U3.11 55.44,19.89 54.02,19.89 ICSP.1
MOSI
  Top 0.3: ICSP.4 53.6,22.11 55.06,20.65 55.84,20.65 59.14,17.35 U3.10
N$1
  Top 0.3: 79.7,3.15 Q1.1
  Top 0.5: R23.2 79.7,3.15
N$2
  Top 0.5: R24.2 79.7,7.15 Q2.1
N$3
  Top 0.5: U$1.2 47.38,30.12 48,29.5 R4.2
N$4
  Top 0.5: R25.2 79.7,11.15 Q3.1
N$5
  Top 0.5: R26.2 79.7,15.15 Q4.1
N$6
  Top 0.5: R3.1 R2.1 88.2,3.15 Q6.1
N$7
  Top 0.5: Q1.3 82.75,1.35 R3.2
N$8
  Top 0.3: 88.2,7.15 Q7.1
  Top 0.5: R5.1 R6.1 88.2,7.15
N$9
  Top 0.5: Q8.1 88.2,11.15 R8.1 R7.1
N$10
  Top 0.5: R9.1 R10.1 88.2,15.15 Q9.1
N$11
  Top 0.5: Q4.3 82.75,13.35 R9.2
N$12
  Top 0.5: Q2.3 82.75,5.35 R5.2
N$14
  Top 0.5: Q3.3 82.75,9.35 R7.2
N$15
  Top 0.5: R28.2 79.7,19.15 Q5.1
N$16
  Top 0.5: Q10.1 86.3,19.2 R16.2 R27.1
N$17
  Top 0.3: U3.32 71.9,13.65 72.27,13.2 73.68,13.2 75.52,15.04 75.52,15.51 76.64,16.64 76.64,19.86 77.29,20.5 83.26,20.5 83.41,20.35 91.75,20.35 R29.1
N$18
  Top 0.5: Q5.3 82.75,17.35 R27.2
N$19
  Top 0.3: R32.2 76.2,26.3 D1.ANODE
N$20
  Top 0.5: Q10.3 91.25,17.35 R11.1
N$23
  Top 0.5: R12.1 91.25,5.35 Q7.3
N$24
  Top 0.5: Q6.3 91.25,1.35 R15.1
N$25
  Top 0.5: Q8.3 91.25,9.35 R13.1
N$27
  Top 0.5: Q9.3 91.25,13.35 R14.1
NEOPIXEL
  Top 0.3: R29.2 94.35,22.9 96.83,20.42 J2.3
NPN1
  Top 0.3: U3.30 70.69,12.53 71.16,12.07 76.47,12.07 R26.1
NPN2
  Top 0.3: U3.29 72.78,9.35 R25.1
NPN3
  Top 0.3: U3.28 75.65,5.35 R24.1
NPN4
  Top 0.3: U3.27 75.96,3.91 75.96,2.54 77.4,1.1 R23.1
NPNCOLON
  Top 0.3: U3.31 71.77,12.63 74.17,12.63 76.12,14.59 76.12,15.28 77.75,16.9 R28.1
PB1  (via drill 0.4)
  Top 0.3: U3.1 64.23,23.23 v64.5,23.5 | S1.1 59.1,30.5 R30.2
  Bottom 0.3: v64.5,23.5 62.45,25.55 61.88,25.55 60.02,27.41 60.02,28.98 58.5,30.5 S1.1
PB2  (via drill 0.4)
  Top 0.3: U3.21 65,10.47 v65,11 | S2.1 70.6,30.5 R31.2
  Bottom 0.3: v65,11 66,11 71,16 75.5,16 80,20.5 82,20.5 83.5,22 83.5,23.5 81,26 76,26 71.5,30.5 S2.1
RD_N
  Top 0.3: U3.3 63.1,21.44 62.55,21.99 62.55,23.13 65.12,25.7 66.08,25.7 arc-90 66.61,25.18 66.61,24.98 arc90 67.13,24.46 67.16,24.46 arc90 67.69,24.98 67.69,25.18 arc-90 68.21,25.7 68.25,25.7 arc-90 68.77,25.18 68.77,24.98 arc90 69.3,24.46 69.33,24.46 arc90 69.85,24.98 69.85,25.18 arc-90 70.38,25.7 70.7,25.7 73.5,28.5 R17.1
RD_P
  Top 0.3: R19.1 74,31 73.01,30.01 73.01,28.93 70.38,26.3 64.88,26.3 61.95,23.37 61.95,21.31 U3.4
RESET
  Top 0.3: U3.13 59.14,13.64 57.36,11.86 R1.2 56.52,11.98 54.69,11.98 54,12.66 54,15.5 51.5,18 51.5,20.17 50.44,21.23 50.44,23.2 52.57,25.33 53.97,25.33 54.83,24.47 56.62,24.47 ICSP.5
SCK
  Top 0.3: ICSP.3 55.5,22.1 U3.9
SCL  (via drill 0.4)
  Top 0.3: U3.18 61.66,10.53 61.66,10.49 61.24,10.07 61.24,7.75 v61,7.5 | R22.2 R33.2 41.1,9.51 42,10.4 43.7,10.4 45.12,8.99 45.12,7.26 46.38,6 v46.5,6
  Top 0.4: R22.2 39.6,5 38.2,5 U1.8
  Bottom 0.3: v46.5,6 59.5,6 v61,7.5 61.37,7.5 61.67,7.8 66.2,7.8 68.5,5.5 83.5,5.5 87,9 87,17.5 95,25.5 J2.1
SDA  (via drill 0.4)
  Top 0.3: U3.19 62,9.74 v62,6.5 | R34.2 R21.2 42,5.15 42,9.58 42.22,9.8 43.49,9.8 44.5,8.79 44.5,6.75 46.25,5 v47.02,5
  Top 0.4: U1.7 40.98,4.13 R21.2
  Bottom 0.3: v47.02,5 60.5,5 v62,6.5 66.5,6.5 68,5 84,5 88,9 88,17 94,23 97.46,23 J2.2
UCAP
  Top 0.3: C9.1 59.49,21.56 61.01,20.04 61.01,20.05 61.37,19.68 U3.6
VBAT  (via drill 0.4)
  Top 0.4: v39,2.5 38.67,2.83 37.84,2.83 U1.6
  Top 0.5: v44.5,2.5 46.5,2.5 48,4 v48,15
  Bottom 0.5: v44.5,2.5 v39,2.5 | B1.POS v48,15
VBUS
  Top 0.3: J1.VBUS 89.55,28.27
  Top 1: 89.55,28.27 89.5,23.55 F1.2
XTAL1
  Top 0.3: U3.17 60.3,10.31 60.38,9.61 R18.2 59.64,5.64 58.44,4.44 C12.2 58.4,4.2 55.33,4.2 Y1.1
XTAL2
  Top 0.3: U3.16 59.01,10.14 R18.1 58.01,10.14 Y1.3 54.15,8.12 C11.2

### Text on the board
tNames: Enix Clock / Argon Prototypes / 01/'19 / V1.2 / Bottom PCB | A | GND | MOSI | 5V | RESET | SCK | MISO